# Altium schematic sheet CONN.SchDoc
size B
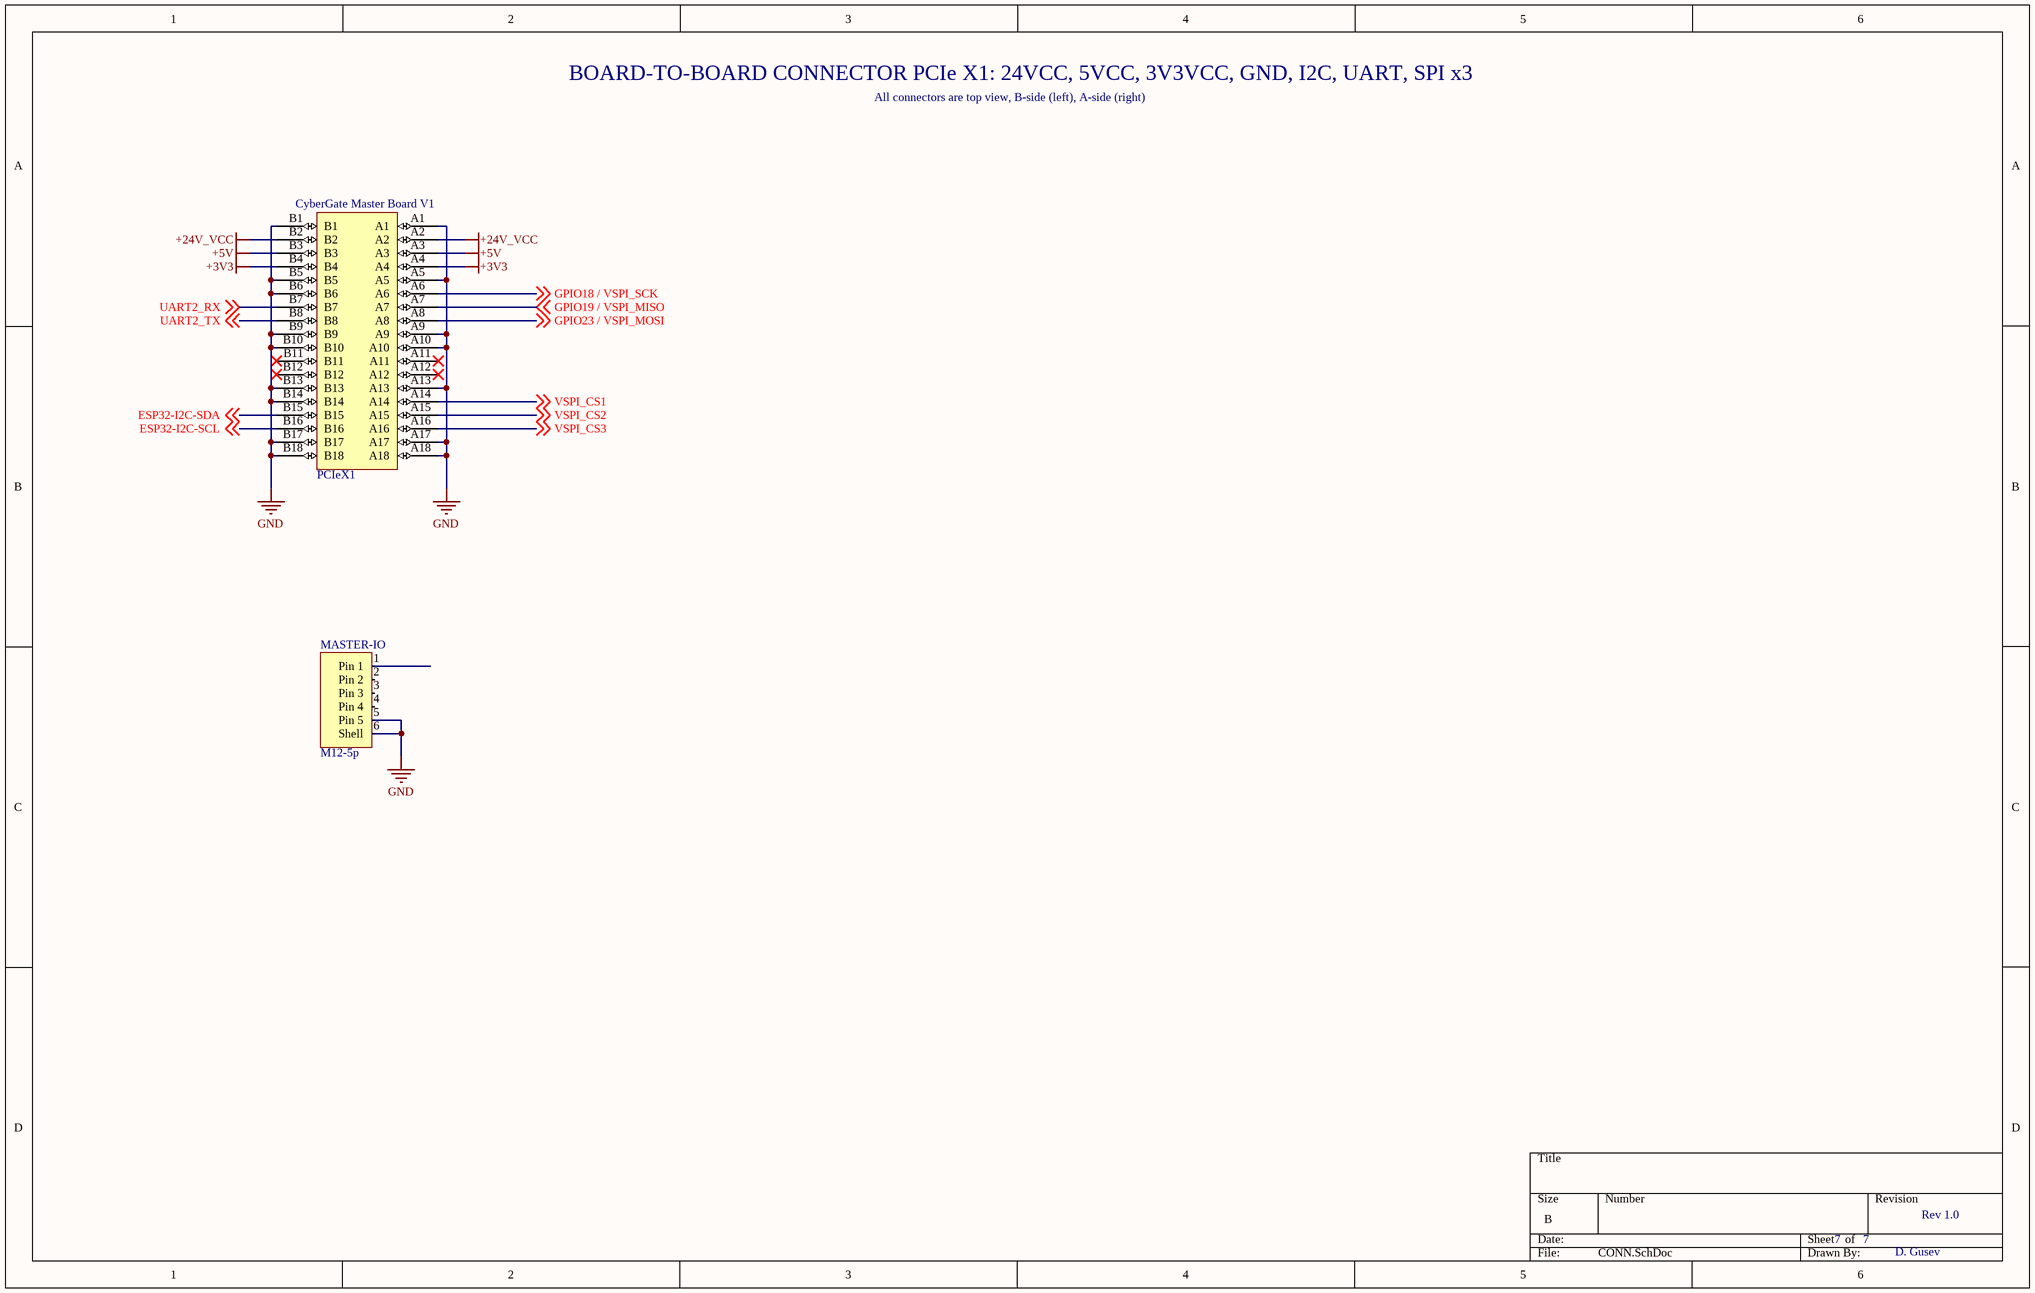
[diagram p0: CONN.SchDoc]

## Parts
CyberGate_Master_Board_V1  PCIeX1  [PCIeX1]
MASTER-IO  M12-5p  [M12-5P]

## Nets
+3V3: CyberGate_Master_Board_V1.A4 CyberGate_Master_Board_V1.B4
+5V: CyberGate_Master_Board_V1.A3 CyberGate_Master_Board_V1.B3
+24V_VCC: CyberGate_Master_Board_V1.A2 CyberGate_Master_Board_V1.B2
GND: CyberGate_Master_Board_V1.A1 CyberGate_Master_Board_V1.A5 CyberGate_Master_Board_V1.A9 CyberGate_Master_Board_V1.A10 CyberGate_Master_Board_V1.A13 CyberGate_Master_Board_V1.A17 CyberGate_Master_Board_V1.A18 CyberGate_Master_Board_V1.B1 CyberGate_Master_Board_V1.B5 CyberGate_Master_Board_V1.B6 CyberGate_Master_Board_V1.B9 CyberGate_Master_Board_V1.B10 CyberGate_Master_Board_V1.B13 CyberGate_Master_Board_V1.B14 CyberGate_Master_Board_V1.B17 CyberGate_Master_Board_V1.B18 MASTER-IO.5(Pin_5) MASTER-IO.6(Shell)
ESP32-I2C-SCL: CyberGate_Master_Board_V1.B16 ; off-sheet ESP32-I2C-SCL
ESP32-I2C-SDA: CyberGate_Master_Board_V1.B15 ; off-sheet ESP32-I2C-SDA
GPIO18 / VSPI_SCK: CyberGate_Master_Board_V1.A6 ; off-sheet GPIO18 / VSPI_SCK
GPIO19 / VSPI_MISO: CyberGate_Master_Board_V1.A7 ; off-sheet GPIO19 / VSPI_MISO
GPIO23 / VSPI_MOSI: CyberGate_Master_Board_V1.A8 ; off-sheet GPIO23 / VSPI_MOSI
UART2_RX: CyberGate_Master_Board_V1.B7 ; off-sheet UART2_RX
UART2_TX: CyberGate_Master_Board_V1.B8 ; off-sheet UART2_TX
VSPI_CS1: CyberGate_Master_Board_V1.A14 ; off-sheet VSPI_CS1
VSPI_CS2: CyberGate_Master_Board_V1.A15 ; off-sheet VSPI_CS2
VSPI_CS3: CyberGate_Master_Board_V1.A16 ; off-sheet VSPI_CS3

Not connected (* = marked no-connect by the designer): CyberGate_Master_Board_V1 A11* A12* B11* B12*; MASTER-IO 1(Pin_1) 2(Pin_2) 3(Pin_3) 4(Pin_4)

## Notes on the sheet
- BOARD-TO-BOARD CONNECTOR PCIe X1: 24VCC, 5VCC, 3V3VCC, GND, I2C, UART, SPI x3
- All connectors are top view, B-side (left), A-side (right)
- 7
- Rev 1.0
- D. Gusev

## Library data of the parts
CyberGate_Master_Board_V1 = PCIeX1: Golden finger, PCIeX16, Dual, Opposite, Pitch 1mm, 164-Position
MASTER-IO = M12-5p: M12 5-pin right angle connector, female